# EAGLE design hat_v3 (EAGLE 7.7.0)

## Sheet 1 of 2
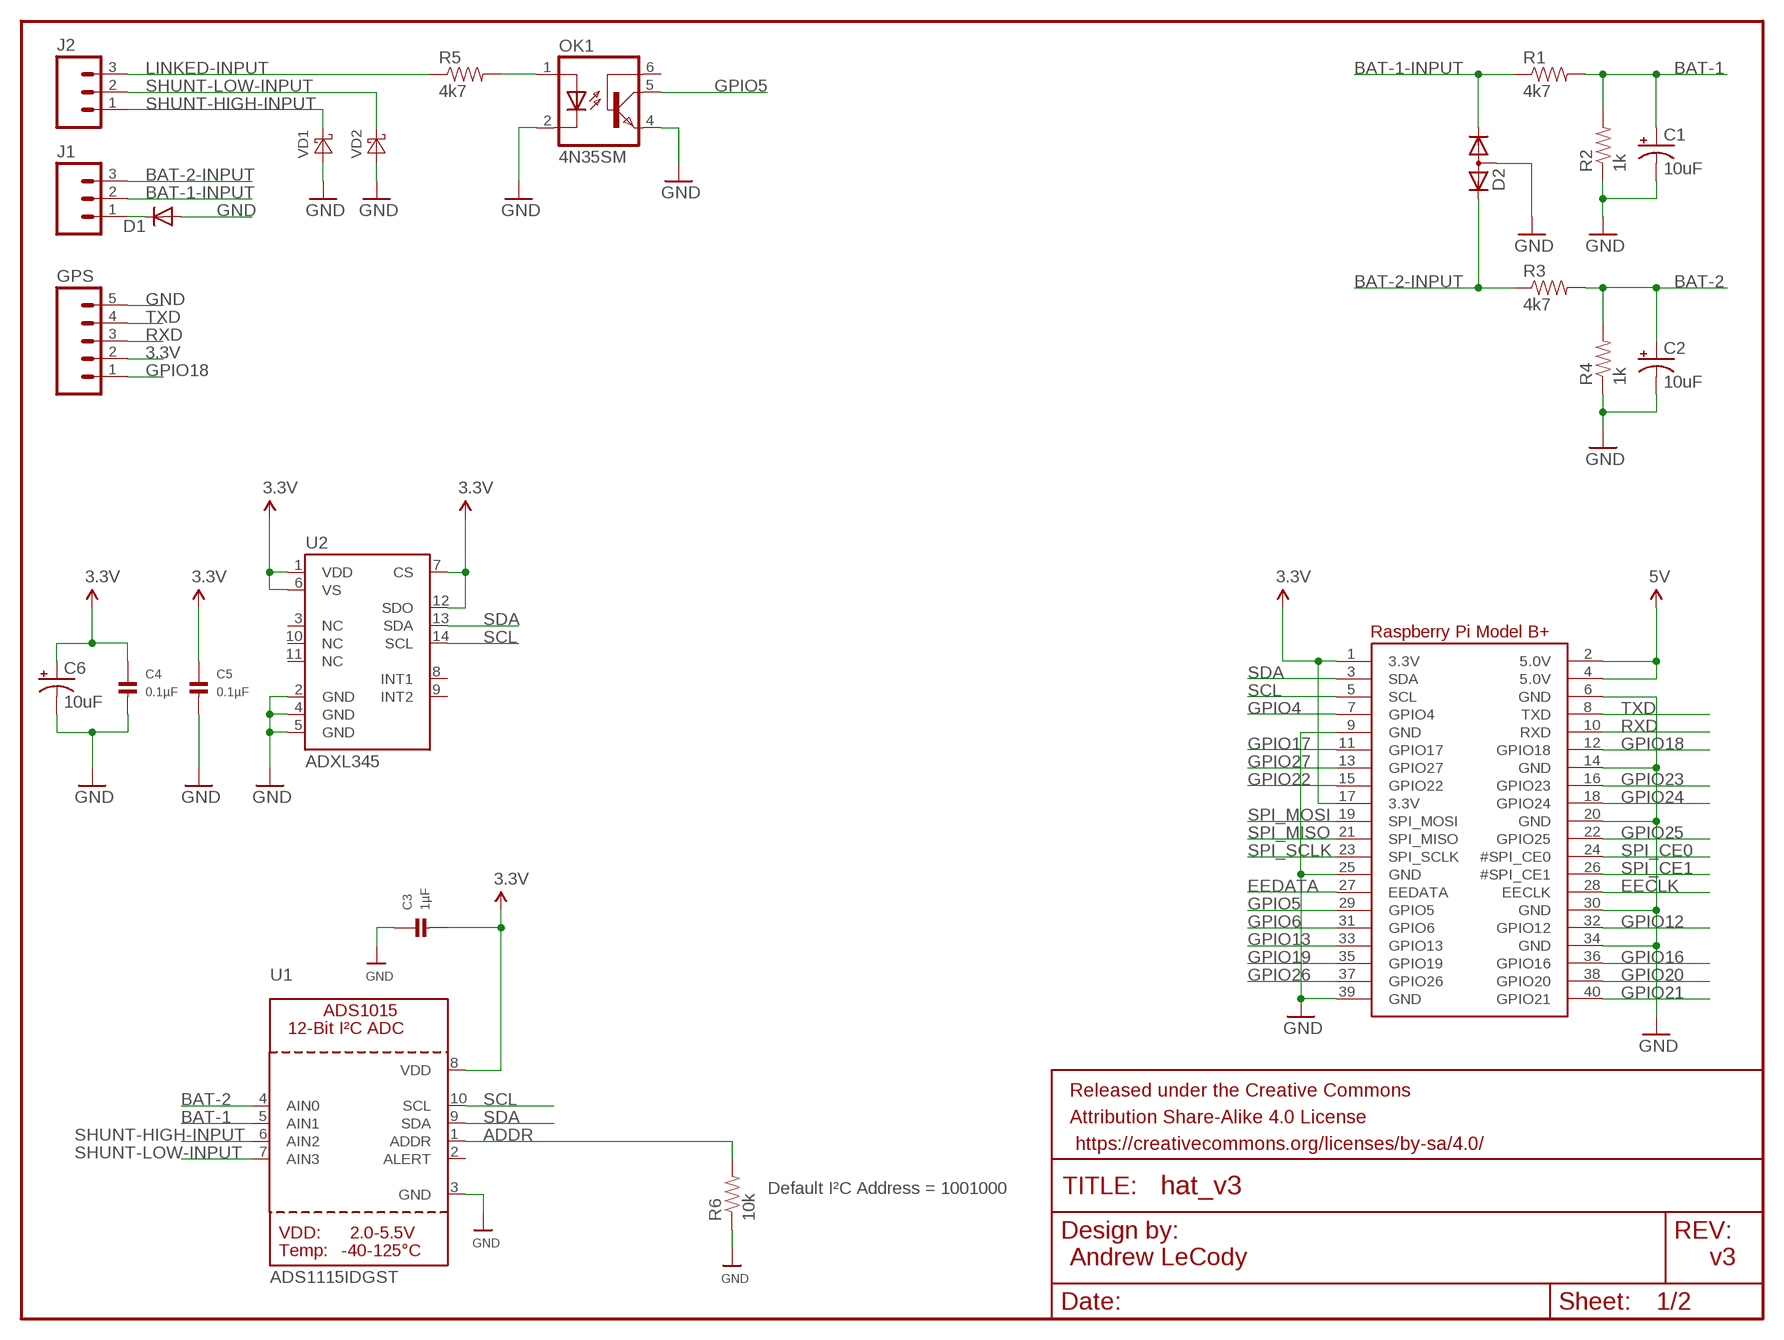
[diagram p0: schematic, sheet 1]

### Parts
C1  10uF  CAP_POL1206  [EIA3216]
C2  10uF  CAP_POL1206  [EIA3216]
C3  1µF  CAP_CERAMIC0805  [0805]
C4  0.1µF  CAP_CERAMIC0805  [0805]
C5  0.1µF  CAP_CERAMIC0805  [0805]
C6  10uF  CAP_POL1206  [EIA3216]
D1  DIODE-DO214AC  [DO214AC]
D2  DIODE-2CA|ACSOT23  [SOT23]
FRAME1  FRAME-LETTER  [CREATIVE_COMMONS]
GPS  M05PTH  [1X05]
J1  M03-SCREW-5MM  [SCREWTERMINAL-5MM-3]
J2  M03-SCREW-5MM  [SCREWTERMINAL-5MM-3]
OK1  4N35SM  [DIL6-SMD]
R1  4k7  RESISTOR0805-RES  [0805]
R2  1k  RESISTOR0805-RES  [0805]
R3  4k7  RESISTOR0805-RES  [0805]
R4  1k  RESISTOR0805-RES  [0805]
R5  4k7  RESISTOR0805-RES  [0805]
R6  10k  RESISTOR0805-RES  [0805]
RPI1  RASPBERRYPI_BPLUS_HATNOSLOTS  [PI_HAT_NOSLOTS]
U1  ADS1115IDGST  ADC_ADS1015  [MSOP10]
U2  ADXL345  [LGA14]
VD1  DIODE-SCHOTTKY-SOD523  [SOD523]
VD2  DIODE-SCHOTTKY-SOD523  [SOD523]

### Nets
3.3V: C3.2 C4.1 C5.1 C6.A(+) GPS.2 RPI1.1(3.3V) RPI1.17(3.3V) U1.8(VDD) U2.1(VDD) U2.6(VS) U2.7(CS) U2.12(SDO) ; also sheet 2
5V: RPI1.2(5.0V) RPI1.4(5.0V) ; also sheet 2
ADDR: R6.2 U1.1(ADDR)
BAT-1: C1.A(+) R1.2 R2.2 U1.5(AIN1)
BAT-1-INPUT: D2.1(K1) J1.2 R1.1
BAT-2: C2.A(+) R3.2 R4.2 U1.4(AIN0)
BAT-2-INPUT: D2.2(K2) J1.3 R3.1
EECLK: RPI1.28(EECLK)
EEDATA: RPI1.27(EEDATA)
GND: C1.C(-) C2.C(-) C3.1 C4.2 C5.2 C6.C(-) D1.A D2.3(A) GPS.5 OK1.2(C) OK1.4(EMI) R2.1 R4.1 R6.1 RPI1.6(GND) RPI1.9(GND) RPI1.14(GND) RPI1.20(GND) RPI1.25(GND) RPI1.30(GND) RPI1.34(GND) RPI1.39(GND) U1.3(GND) U2.2(GND) U2.4(GND) U2.5(GND) VD1.A VD2.A ; also sheet 2
GPIO4: RPI1.7(GPIO4)
GPIO5: OK1.5(COL) RPI1.29(GPIO5)
GPIO6: RPI1.31(GPIO6)
GPIO12: RPI1.32(GPIO12)
GPIO13: RPI1.33(GPIO13)
GPIO16: RPI1.36(GPIO16)
GPIO17: RPI1.11(GPIO17)
GPIO18: GPS.1 RPI1.12(GPIO18)
GPIO19: RPI1.35(GPIO19)
GPIO20: RPI1.38(GPIO20)
GPIO21: RPI1.40(GPIO21)
GPIO22: RPI1.15(GPIO22)
GPIO23: RPI1.16(GPIO23)
GPIO24: RPI1.18(GPIO24)
GPIO25: RPI1.22(GPIO25) ; also sheet 2
GPIO26: RPI1.37(GPIO26)
GPIO27: RPI1.13(GPIO27)
LINKED-INPUT: J2.3 R5.1
N$3: OK1.1(A) R5.2
RXD: GPS.3 RPI1.10(RXD)
SCL: RPI1.5(SCL) U1.10(SCL) U2.14(SCL)
SDA: RPI1.3(SDA) U1.9(SDA) U2.13(SDA)
SHUNT-HIGH-INPUT: J2.1 U1.6(AIN2) VD1.C
SHUNT-LOW-INPUT: J2.2 U1.7(AIN3) VD2.C
SPI_CE0: RPI1.24(#SPI_CE0) ; also sheet 2
SPI_CE1: RPI1.26(#SPI_CE1)
SPI_MISO: RPI1.21(SPI_MISO) ; also sheet 2
SPI_MOSI: RPI1.19(SPI_MOSI) ; also sheet 2
SPI_SCLK: RPI1.23(SPI_SCLK) ; also sheet 2
TXD: GPS.4 RPI1.8(TXD)
VEHICLE-GND: D1.C J1.1
Unconnected: OK1.6(BAS) U1.2(ALERT) U2.3(NC) U2.8(INT1) U2.9(INT2) U2.10(NC) U2.11(NC)

### Notes on the sheet
- Default I²C Address = 1001000
- Andrew LeCody | v3

## Sheet 2 of 2
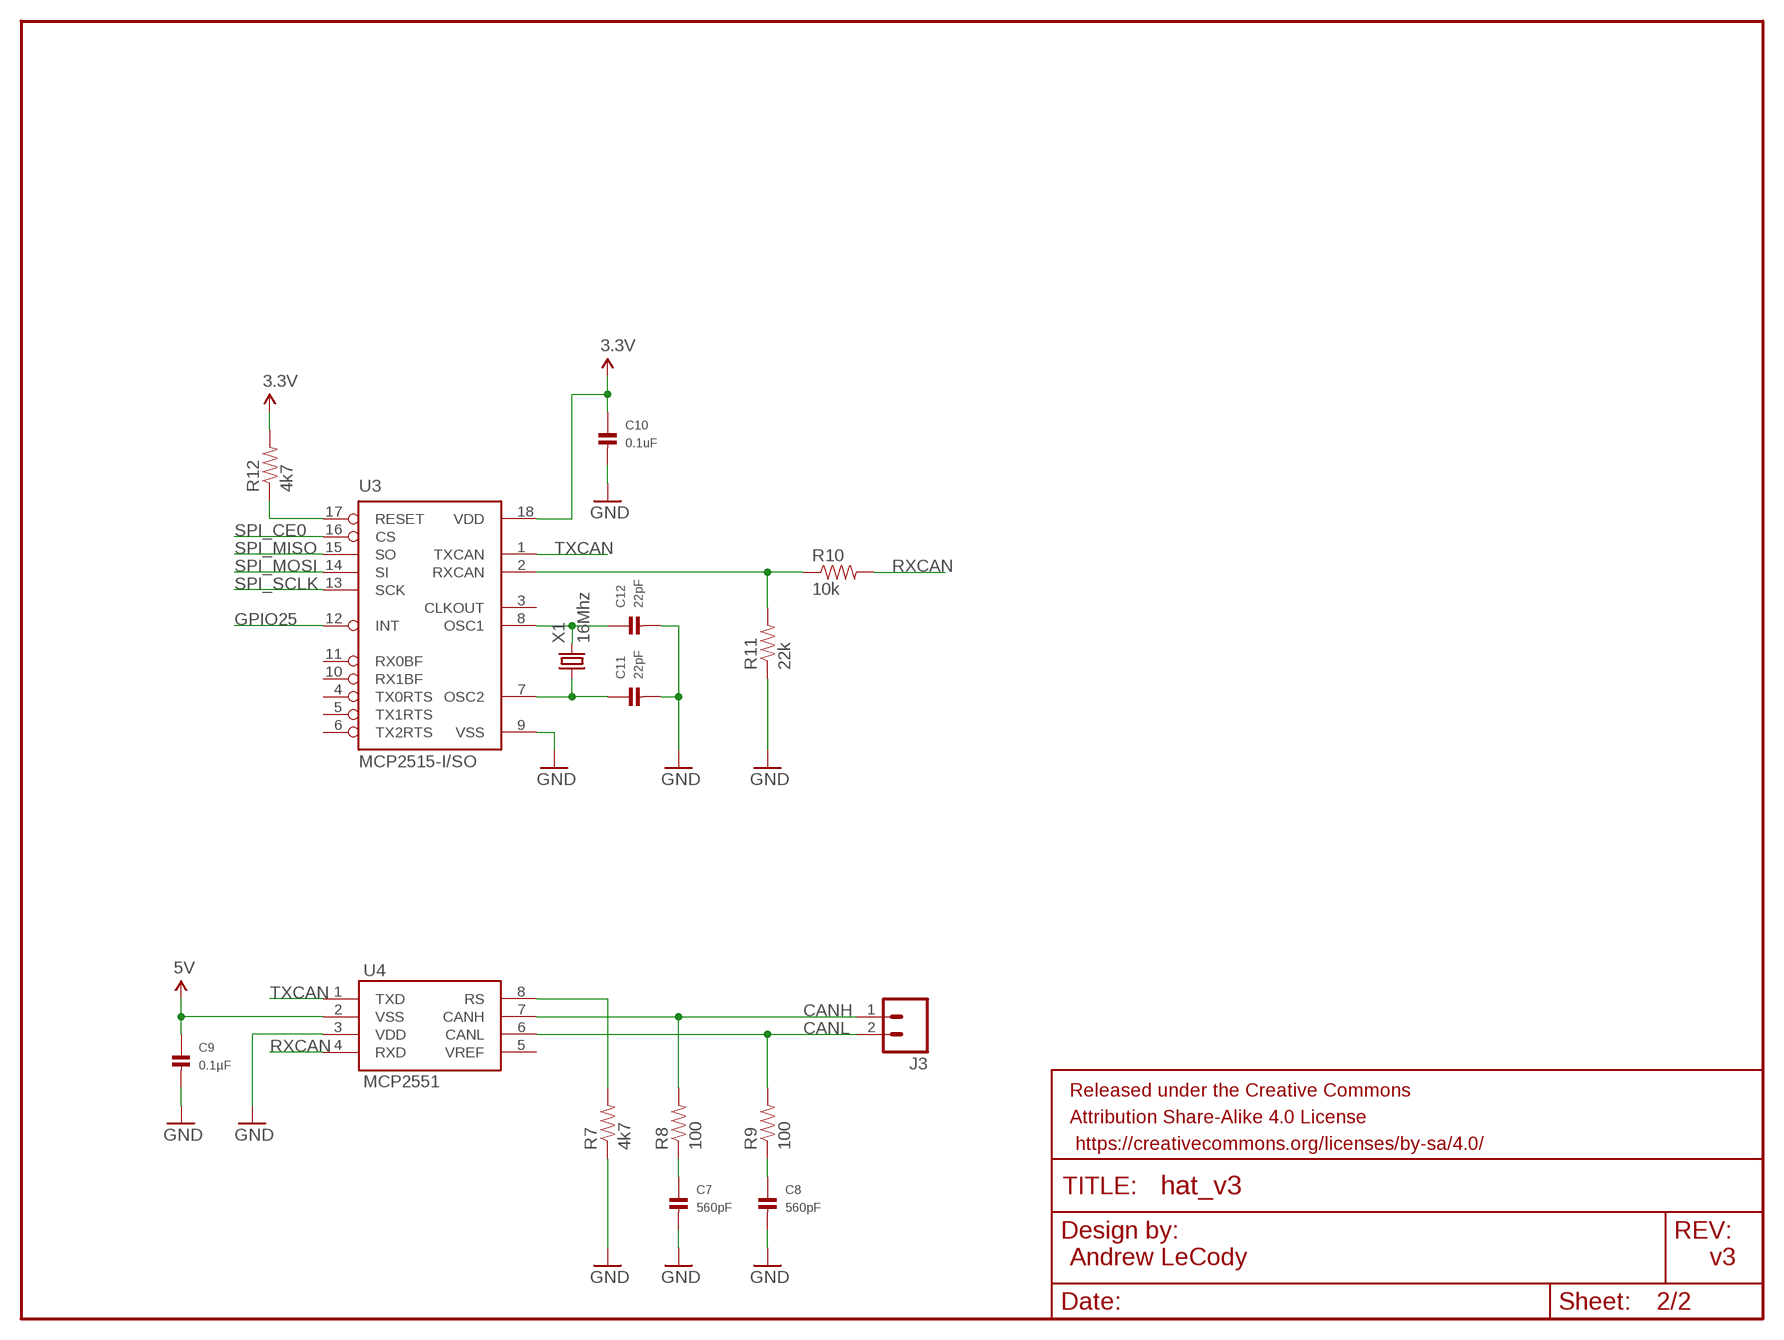
[diagram p1: schematic, sheet 2]

### Parts
C7  560pF  CAP_CERAMIC0805  [0805]
C8  560pF  CAP_CERAMIC0805  [0805]
C9  0.1µF  CAP_CERAMIC0805  [0805]
C10  0.1uF  CAP_CERAMIC0805  [0805]
C11  22pF  CAP_CERAMIC0805  [0805]
C12  22pF  CAP_CERAMIC0805  [0805]
FRAME2  FRAME-LETTERNO_PACKAGE  [DUMMY]
J3  M025MM  [SCREWTERMINAL-5MM-2]
R7  4k7  RESISTOR0805-RES  [0805]
R8  100  RESISTOR0805-RES  [0805]
R9  100  RESISTOR0805-RES  [0805]
R10  10k  RESISTOR0805-RES  [0805]
R11  22k  RESISTOR0805-RES  [0805]
R12  4k7  RESISTOR0805-RES  [0805]
U3  MCP2515-I/SO  [SO18L]
U4  MCP2551  [SO08]
X1  16Mhz  CRYSTALS-NOGND-4-HSMX  [HC49-4-HSMX]

### Nets
3.3V: C10.1 R12.2 U3.18(VDD) ; also sheet 1
5V: C9.1 U4.2(VSS) ; also sheet 1
CANH: J3.1 R8.2 U4.7(CANH)
CANL: J3.2 R9.2 U4.6(CANL)
GND: C7.2 C8.2 C9.2 C10.2 C11.2 C12.2 R7.1 R11.1 U3.9(VSS) U4.3(VDD) ; also sheet 1
GPIO25: U3.12(INT) ; also sheet 1
N$4: R10.1 R11.2 U3.2(RXCAN)
N$6: C7.1 R8.1
N$8: C8.1 R9.1
N$14: C12.1 U3.8(OSC1) X1.2
N$15: C11.1 U3.7(OSC2) X1.1
RS: R7.2 U4.8(RS)
RXCAN: R10.2 U4.4(RXD)
SPI_CE0: U3.16(CS) ; also sheet 1
SPI_MISO: U3.15(SO) ; also sheet 1
SPI_MOSI: U3.14(SI) ; also sheet 1
SPI_SCLK: U3.13(SCK) ; also sheet 1
TXCAN: U3.1(TXCAN) U4.1(TXD)
U5_RST: R12.1 U3.17(RESET)
Unconnected: U3.3(CLKOUT) U3.4(TX0RTS) U3.5(TX1RTS) U3.6(TX2RTS) U3.10(RX1BF) U3.11(RX0BF) U4.5(VREF)

### Notes on the sheet
- Andrew LeCody | v3

## Library data of the parts
C1 C2 C6 = SparkFun-Capacitors:CAP_POL: Capacitor Polarized These are standard SMD and PTH capacitors. Normally 10uF, 47uF, and 100uF in electrolytic and tantalum varieties. Always verify the external diameter of the through hole cap, it varies with capacity, voltage, and manufacturer. The EIA devices should be standard.
C3-C5 C7-C12 = microbuilder:CAP_CERAMIC: Ceramic Capacitors 0402 - 0402 Surface Mount Capacitors 16pF 50V 5% [Digikey: 445-4899-2-ND] 18pF 50V 5% [Digikey: 490-1281-2-ND] 22pF 50V 5% [Digikey: 490-1283-2-ND] 68pF 50V 5% [Digikey: 490-1289-2-ND] 0.1uF 10V 10% [Digikey: 490-1318-2-ND] 1.0uF 6.3V 10% [Digikey: 490-1320-2-ND] 0603 - 0603 Surface Mount Capacitors 16 pF 50V 5% [Digikey: 445-5051-2-ND] 22 pF 50V [Digikey: PCC220ACVTR-ND] 33 pF 50V 5% [Digikey: 490-1415-1-ND] 56pF 50V 5% [Digikey: 490-1421-1-ND] 220pF 50V 5% [Digikey: 445-1285-1-ND] 680 pF 50V 2200 pF 50V 5% C0G [Digikey: 445-1297-1-ND] 5600 pF 100V 5% X7R [Digikey: 478-3711-1-ND] 0.1 µF 25V 10% [Digikey: PCC2277TR-ND] 0.22 µF 16V 10% X7R [Digikey: 445-1318-1-ND] 1.0 µF 25V 10% [Digikey: 445-5146-2-ND] 0603 - RF Specific 3pF 250V +/-0.1pF RF [Digikey: 712-1347-1-ND] 18 pF 250V 5% [Digikey: 478-3505-1-ND or 712-1322-1-ND] 56 pF 250V 5% C0G RF [Digikey: 490-4867-1-ND] 68 pF 250V RF [Digikey: 490-4868-1-ND] 0805 - 0805 Surface Mount Capacitors 220 pF 250V 2% RF Ceramic Capacitor [Digikey: 712-1398-1-ND] 1000 pF 50V 2% NP0 Ceramic Capacitor [Digikey: 478-3760-1-ND] 0.1 µF 25V 10% Ceramic Capacitor [Digikey: PCC1828TR-ND] 1.0 µF 16V 10% Ceramic Capacitor[Digikey: 490-1691-2-ND] 10.0 µF 10V 10% Ceramic Capacitor[Digikey: 709-1228-1-ND] 10.0 uF 16V 10% Ceramic Capacitor [Digikey: 478-5165-2-ND] 47 uF 6.3V 20% Ceramic Capacitor [Digikey: 587-1779-1-ND or 399-5506-1-ND] 1206 - 1206 Surface Mount Capacitors 47uF 10V 20% Ceramic Capacitor [Digikey: 490-5528-1-ND or 399-5508-1-ND or 445-6010-1-ND] 100uF 6.3V -20%, +80% Y5V Ceramic Capacitor (Digikey: 490-4512-1-ND, Mouser: 81-GRM31CF50J107ZE1L)
D1 = diode:DIODE-: DIODE
D2 = diode:DIODE-2CA|AC: Dual DIODE Cathode-Anode|Anode-Cathode
FRAME1 = SparkFun-Aesthetics:FRAME-LETTER: Schematic Frame Standard 8.5x11 US Letter frame
FRAME2 = SparkFun-Aesthetics:FRAME-LETTER: Schematic Frame Standard 8.5x11 US Letter frame; DESIGNER: Nobody; VERSION: v01
GPS = SparkFun-Connectors:M05: Header 5 Standard 5-pin 0.1" header. Use with straight break away headers (SKU : PRT-00116), right angle break away headers (PRT-00553), swiss pins (PRT-00743), machine pins (PRT-00117), and female headers (PRT-00115). Molex polarized connector foot print use with SKU : PRT-08230 with associated crimp pins and housings.
J1 J2 = SparkFun-Connectors:M03: Header 3 Standard 3-pin 0.1" header. Use with straight break away headers (SKU : PRT-00116), right angle break away headers (PRT-00553), swiss pins (PRT-00743), machine pins (PRT-00117), and female headers (PRT-00115). Molex polarized connector foot print use with SKU : PRT-08232 with associated crimp pins and housings.; STOREFRONT_ID: PRT-08433
J3 = SparkFun-Connectors:M02: Standard 2-pin 0.1" header. Use with - straight break away headers ( PRT-00116) - right angle break away headers (PRT-00553) - swiss pins (PRT-00743) - machine pins (PRT-00117) - female headers (PRT-00115) Molex polarized connector foot print use with: PRT-08233 with associated crimp pins and housings. 2.54_SCREWTERM for use with PRT-10571. 3.5mm Screw Terminal footprints for PRT-08084 5mm Screw Terminal footprints for use with PRT-08432; STOREFRONT_ID: PRT-08432
OK1 = optocoupler:4N*?M: General Purpose 6-Pin Phototransistor Optocouplers Source: http://www.fairchildsemi.com/ds/4N/4N35-M.pdf; MF: FAIRCHILD SEMICONDUCTOR; MPN: 4N35S-M; OC_FARNELL: 1021179; OC_NEWARK: 67K2285
R1-R12 = SparkFun-Passives:RESISTOR: Resistor Basic schematic elements and footprints for 0603, 1206, and PTH resistors.
RPI1 = microbuilder:RASPBERRYPI_BPLUS
U1 = microbuilder:ADC_ADS1015: ADS1015 - 12-bit 4-Channel I2C ADC with Internal PGA VDD: 2.0-5.5V Sampling Rate: 3.3ksps Gain Settings: 2/3, 1, 2, 4, 8, 16 I2C Address: ADDR low = 1001000x, ADDR high = 1001001x Internal Comparator The ADS1015 includes an internal comparator that can be set to output a high-level on ALERT when the conversion results exceeeds a pre-defined upper level, and will deassert itself when the level falls below a pre-defined lower threshold level. It can also be set to windowed mode where the ALERT pin will be asserted if the data exceeds the upper threshold or falls below the lower threshold.
U2 = SparkFun-Sensors:ADXL345: 3-axis SPI/I2C 2/4/8/16g accelerometer
U3 = mcp2515:MCP2515
U4 = SparkFun-DigitalIC:MCP2551: CAN transceiver; PROD_ID: IC-09907
VD1 VD2 = diode:DIODE-SCHOTTKY-: SCHOTTKY DIODE
X1 = IQD-Frequency-Products:CRYSTALS-NOGND: CRYSTALS CAN NOT GROUNDED

## Board
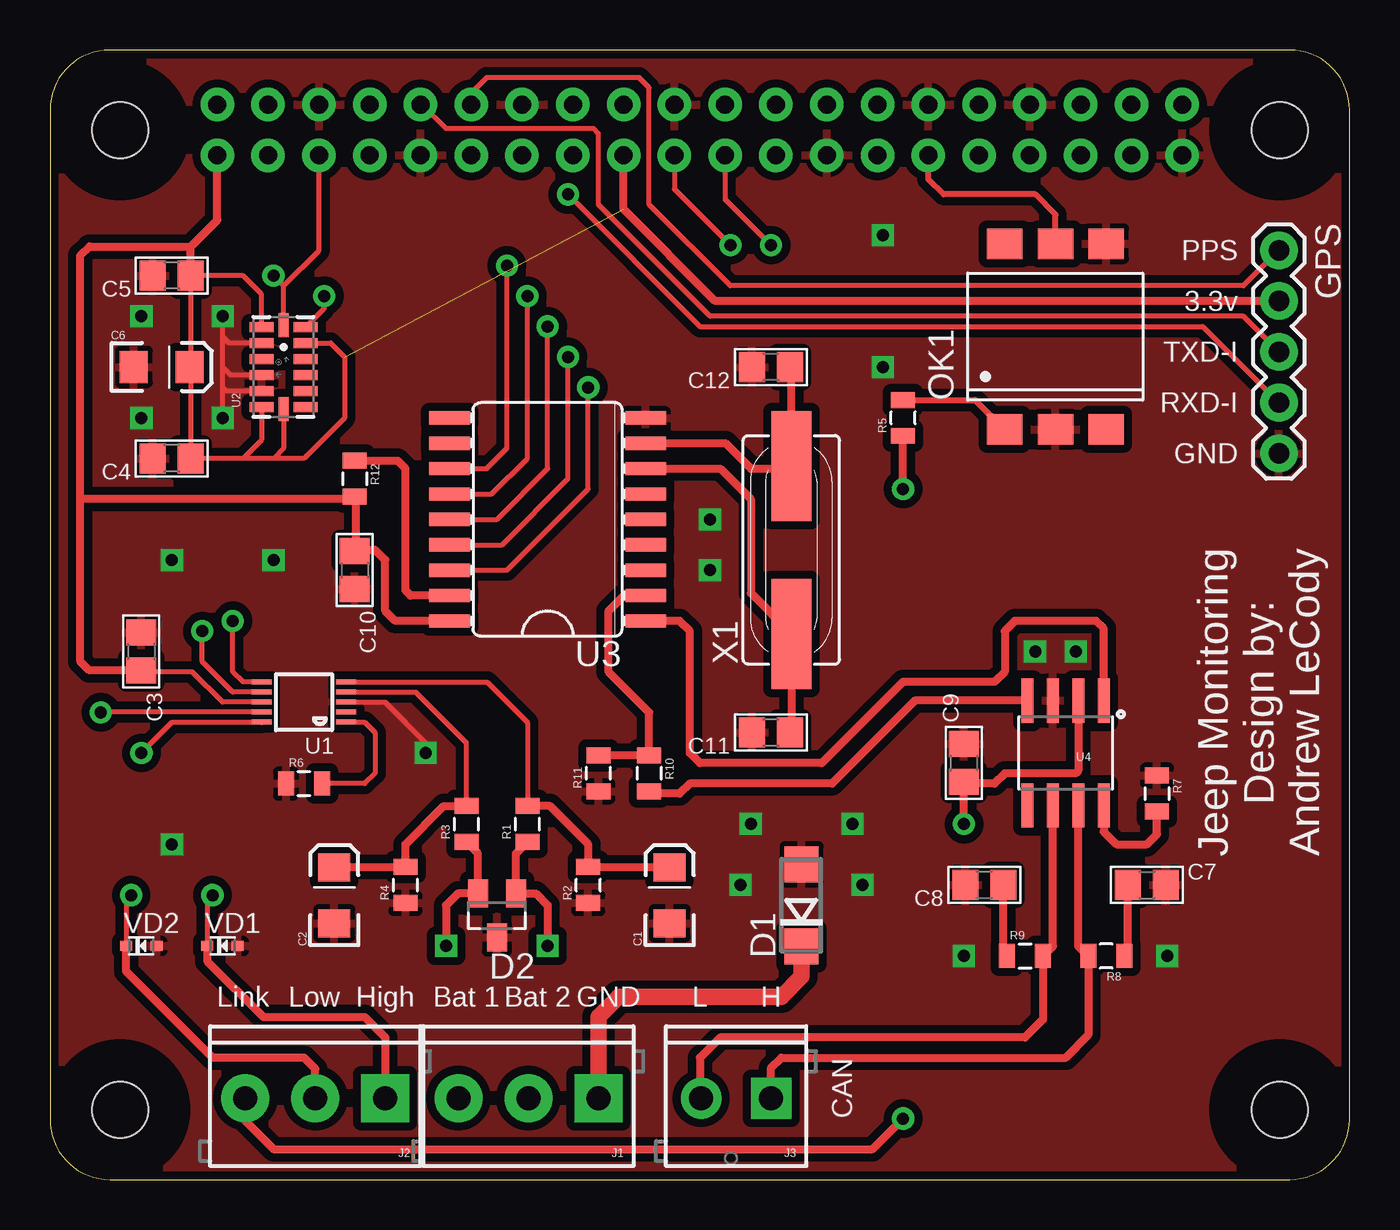
[diagram p2: board, top side]
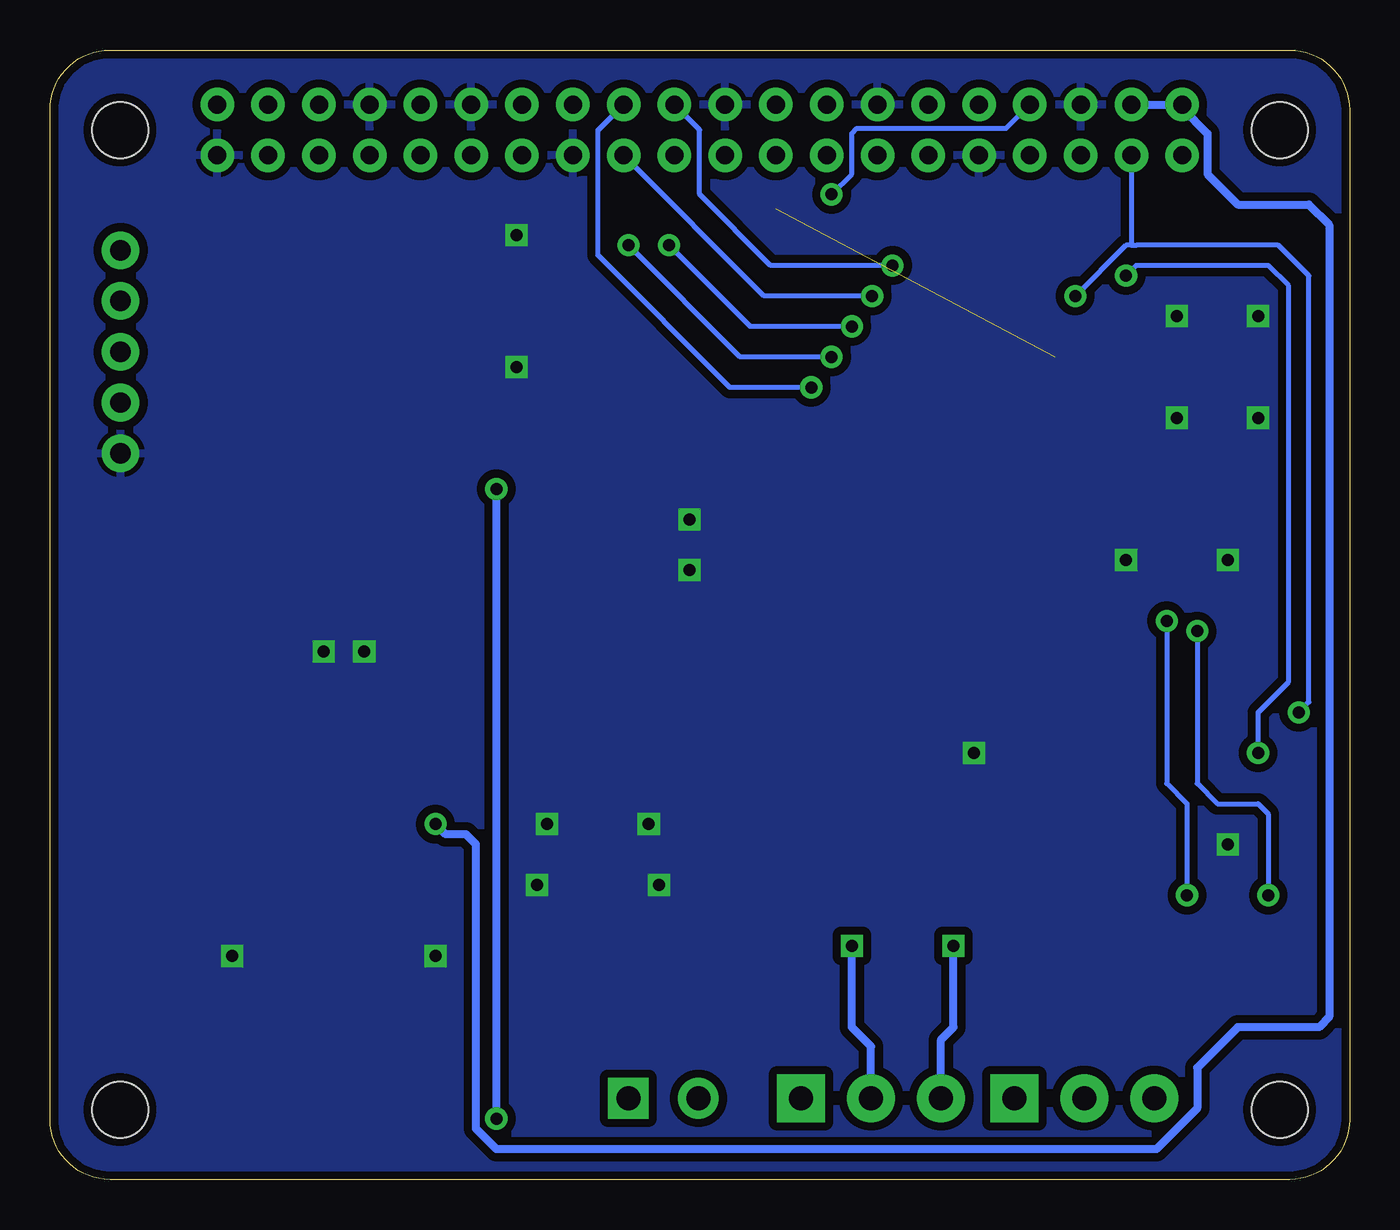
[diagram p3: board, bottom side, seen from below]

Size 65 x 56.5 mm. Coordinates in mm from the lower left corner, seen from the top.
Copper layers (1*16): Top 0.035mm / dielectric 1.5mm / Bottom 0.035mm
Design rules "SparkFun": minimum track width 8mil, minimum drill 20mil, track to track 8mil, track to pad 8mil, pad to pad 8mil, via to via 8mil, smd to smd 8mil, copper to edge 8mil, drill to drill 8mil, minimum pad ring 12mil, minimum via ring 10mil, stop-mask expansion 4mil, vias tented up to drill 20mil, thermal gap 10mil

### Footprints (pad centres in the part's own frame; a part is rotated, then mirrored left to right if it is on the bottom)
EIA3216 = smd 1.4 x 1.6: A 1.4,0; C -1.4,0
0805 = smd 1.3 x 1.5: 1 -0.95,0; 2 0.95,0
DO214AC = smd 1.8 x 1.7: A 2.05,0; C -2.05,0
SOT23 = smd 1 x 1.4: 1 -0.95,-1.1; 2 0.95,-1.1; 3 0,1.1
1X05 = drill 1.016 pad 1.88: 1 0,0; 2 2.54,0; 3 5.08,0; 4 7.62,0; 5 10.16,0
SCREWTERMINAL-3.5MM-3 = drill 1.2 pad 2.413 square: 1 0,0 | drill 1.2 pad 2.413: 2 3.5,0; 3 7,0
SCREWTERMINAL-3.5MM-2 = drill 1.2 pad 2.032 square: 1 0,0 | drill 1.2 pad 2.032: 2 3.5,0
DIL6-SMD = smd 1.78 x 1.52: 1 -2.54,-4.645; 2 0,-4.645; 3 2.54,-4.645; 4 2.54,4.645; 5 0,4.645; 6 -2.54,4.645
0805' = smd 0.8 x 1.2: 1 -0.9,0; 2 0.9,0
PI_HAT_NOSLOTS = drill 0.9 pad 1.676: 1 8.37,51.23; 2 8.37,53.77; 3 10.91,51.23; 4 10.91,53.77; 5 13.45,51.23; 6 13.45,53.77; 7 15.99,51.23; 8 15.99,53.77; 9 18.53,51.23; 10 18.53,53.77; 11 21.07,51.23; 12 21.07,53.77; 13 23.61,51.23; 14 23.61,53.77; 15 26.15,51.23; 16 26.15,53.77; 17 28.69,51.23; 18 28.69,53.77; 19 31.23,51.23; 20 31.23,53.77; 21 33.77,51.23; 22 33.77,53.77; 23 36.31,51.23; 24 36.31,53.77; 25 38.85,51.23; 26 38.85,53.77; 27 41.39,51.23; 28 41.39,53.77; 29 43.93,51.23; 30 43.93,53.77; 31 46.47,51.23; 32 46.47,53.77; 33 49.01,51.23; 34 49.01,53.77; 35 51.55,51.23; 36 51.55,53.77; 37 54.09,51.23; 38 54.09,53.77; 39 56.63,51.23; 40 56.63,53.77 | hole 2.8: 3.5,3.5; 3.5,52.5; 61.5,52.5; 61.5,3.5
MSOP10 = smd 0.25 x 1: 1 -1,-2.113; 2 -0.5,-2.113; 3 0,-2.113; 4 0.5,-2.113; 5 1,-2.113; 6 1,2.113; 7 0.5,2.113; 8 0,2.113; 9 -0.5,2.113; 10 -1,2.113
LGA14 = smd 0.5 x 1.2: 1 2,1.1; 2 1.2,1.1; 3 0.4,1.1; 4 -0.4,1.1; 5 -1.2,1.1; 6 -2,1.1; 8 -2,-1.1; 9 -1.2,-1.1; 10 -0.4,-1.1; 11 0.4,-1.1; 12 1.2,-1.1; 13 2,-1.1 | smd 1.2 x 0.5: 7 -2.1,0; 14 2.1,0
SO18L = smd 0.66 x 2.032: 1 -5.08,-4.902; 2 -3.81,-4.902; 3 -2.54,-4.902; 4 -1.27,-4.902; 5 0,-4.902; 6 1.27,-4.902; 7 2.54,-4.902; 8 3.81,-4.902; 9 5.08,-4.902; 10 5.08,4.902; 11 3.81,4.902; 12 2.54,4.902; 13 1.27,4.902; 14 0,4.902; 15 -1.27,4.902; 16 -2.54,4.902; 17 -3.81,4.902; 18 -5.08,4.902
SO08 = smd 0.61 x 2.21: 1 -1.905,-2.616; 2 -0.635,-2.616; 3 0.635,-2.616; 4 1.905,-2.616; 5 1.905,2.616; 6 0.635,2.616; 7 -0.635,2.616; 8 -1.905,2.616
SOD523 = smd 0.6 x 0.5: A 0.762,0; C -0.762,0
HC49-4-HSMX = smd 5.5 x 2: 1 -4.2,0; 2 4.2,0

### Placement (x,y rotation side)
C1  30.99,14.22 90 top
C2  14.22,14.22 90 top
C3  4.57,26.42 270 top
C4  6.1,36.07 180 top
C5  6.1,45.21 180 top
C6  5.59,40.64 0 top
C7  54.86,14.73 0 top
C8  46.74,14.73 180 top
C9  45.72,20.83 90 top
C10  15.24,30.48 270 top
C11  36.07,22.35 180 top
C12  36.07,40.64 180 top
D1  37.59,13.72 90 top
D2  22.35,13.21 180 top
FRAME1  2.54,-8.89 0 top  (outside the outline)
FRAME2  -32.51,-66.04 0 top  (outside the outline)
GPS  61.47,46.48 270 top
J1  [SCREWTERMINAL-3.5MM-3]  27.43,4.06 180 top
J2  [SCREWTERMINAL-3.5MM-3]  16.76,4.06 180 top
J3  [SCREWTERMINAL-3.5MM-2]  36.07,4.06 180 top
OK1  50.29,42.16 0 top
R1  4k7  [0805']  23.88,17.78 90 top
R2  1k  [0805']  26.92,14.73 90 top
R3  4k7  [0805']  20.83,17.78 90 top
R4  1k  [0805']  17.78,14.73 90 top
R5  4k7  [0805']  42.67,38.1 90 top
R6  10k  [0805']  12.7,19.81 0 top
R7  4k7  [0805']  55.37,19.3 270 top
R8  100  [0805']  52.83,11.18 180 top
R9  100  [0805']  48.77,11.18 0 top
R10  10k  [0805']  29.97,20.32 270 top
R11  22k  [0805']  27.43,20.32 90 top
R12  4k7  [0805']  15.24,35.05 270 top
RPI1  0,0 0 top
U1  12.7,23.88 90 top
U2  11.68,40.64 90 top
U3  24.89,33.02 90 top
U4  50.8,21.34 180 top
VD1  8.64,11.68 0 top
VD2  4.57,11.68 0 top
X1  37.08,31.5 90 top

### Tracks (layer width: path | path; a pad name or v marks a point on that pad's centre or on a via)
3.3V  (1 unrouted)
  Top 0.254: 7.05,40.7 C5.1 9.65,45.21 10.58,44.28 U2.1 | 7.05,40.7 C6.A | 7.05,40.7 C4.1 9.65,36.07 | U2.6 10.58,37 9.65,36.07 | U2.7 11.68,36.58 11.18,36.07 | 11.18,36.07 9.65,36.07 | U2.12 14.04,41.84 14.73,41.15 14.73,38.1 12.7,36.07 11.18,36.07 | U1.8 8.64,23.88 7.11,25.4 4.64,25.4 C3.2 | R12.2 15.24,34.04
  Top 0.406: GPS.2 33.27,43.94 28.69,48.53 RPI1.17 | U3.18 17.27,27.94 16.76,28.45 16.76,30.99 16.26,31.5 15.31,31.5 | C10.1 15.31,31.5 | 15.31,31.5 15.31,34.09 R12.2 | C5.1 7.05,46.67 | 7.05,46.67 8.37,47.99 RPI1.1 | 7.05,46.67 1.97,46.67 1.52,46.23 1.52,34.04 | C3.2 1.97,25.47 1.52,25.91 1.52,34.04 | 15.24,34.04 1.52,34.04
5V  (via drill 0.6)
  Top 0.406: v45.72,17.78 C9.1 45.79,19.81 47.24,19.81 47.75,20.32 51.31,20.32 51.44,20.45 U4.2
  Bottom 0.406: v45.72,17.78 45.21,17.27 44.2,17.27 43.69,16.76 43.69,2.54 42.67,1.52 9.65,1.52 7.62,3.56 7.62,5.59 5.59,7.62 1.52,7.62 1.02,8.13 1.02,47.75 2.03,48.77 5.59,48.77 7.11,50.29 7.11,52.32 8.37,53.58 RPI1.2 RPI1.4
ADDR
  Top 0.254: U1.1 15.73,22.88 16.26,22.35 16.26,20.32 15.75,19.81 R6.2
BAT-1
  Top 0.254: U1.5 21.86,24.88 23.88,22.86 R1.2
  Top 0.406: C1.A 26.93,15.62 | 26.93,15.62 R2.2 | 26.93,15.62 26.93,16.76 25.01,18.68 R1.2
BAT-1-INPUT  (via drill 0.6)
  Top 0.406: R1.1 23.3,16.31 D2.1 24.3,14.31 24.89,13.72 v24.89,11.68
  Bottom 0.406: J1.2 23.93,6.66 24.89,7.62 v24.89,11.68
BAT-2
  Top 0.254: R3.2 20.83,21.84 18.3,24.38 U1.4
  Top 0.406: C2.A 14.23,15.63 R4.2 17.78,16.76 19.7,18.68 R3.2
BAT-2-INPUT  (via drill 0.6)
  Top 0.406: R3.1 21.4,16.31 D2.2 20.4,14.31 19.81,13.72 v19.81,11.68
  Bottom 0.406: J1.3 20.43,7 19.81,7.62 v19.81,11.68
CANH
  Top 0.406: U4.7 51.44,11.67 R8.2 51.93,7.23 50.8,6.1 36.58,6.1 36.07,5.59 J3.1
CANL
  Top 0.406: U4.6 50.16,11.67 R9.2 49.67,8.01 48.77,7.11 33.53,7.11 32.51,6.1 32.51,4.12 J3.2
GND  (via drill 0.6)
  Top 0.254: U1.3 16.76,23.88 18.8,21.84 v18.8,21.34 | U2.2 8.96,41.84 8.64,42.16 | 8.64,42.16 v8.64,43.18 | U2.4 9.04,40.24 8.64,40.64 | 8.64,40.64 8.64,42.16 | U2.5 8.82,39.44 8.64,39.62 | 8.64,39.62 8.64,40.64 | v8.64,38.1 8.64,39.62
  other vias: 33.02,33.02 33.02,30.48 49.28,26.42 51.31,26.42 40.13,17.78 35.05,17.78 34.54,14.73 4.57,43.18 4.57,38.1 6.1,30.99 11.18,30.99 6.1,16.76 45.72,11.18 55.88,11.18 40.64,14.73 41.66,40.64 41.66,47.24
  pour Bottom (isolate 0.406): 66.04,-1.27 66.04,57.15 -1.27,57.15 -1.27,-1.27
  pour Top (isolate 0.406): -1.27,57.15 66.04,57.15 66.04,-1.27 -1.27,-1.27
GPIO5
  Top 0.305: OK1.5 50.29,48.26 49.28,49.28 44.7,49.28 43.93,50.05 RPI1.29
GPIO18
  Top 0.254: GPS.1 59.69,44.7 34.04,44.7 29.97,48.77 29.97,54.61 29.46,55.12 21.84,55.12 21.07,54.34 RPI1.12
GPIO25  (via drill 0.6)
  Top 0.254: U3.12 21.84,35.56 22.86,36.58 v22.86,45.72
  Bottom 0.254: RPI1.22 32.51,52.51 32.51,49.28 28.96,45.72 v22.86,45.72
LINKED-INPUT  (via drill 0.6)
  Top 0.406: J2.3 9.76,2.94 11.18,1.52 41.15,1.52 v42.67,3.05 | v42.67,34.54 R5.1
  Bottom 0.406: v42.67,3.05 v42.67,34.54
N$3
  Top 0.305: R5.2 46.27,39 OK1.1
N$4
  Top 0.406: R11.2 R10.1 29.97,23.37 27.94,25.4 27.94,28.45 28.7,29.21 U3.2
N$6
  Top 0.406: R8.1 53.91,11.36 C7.1
N$8
  Top 0.406: R9.1 47.69,11.36 C8.1
N$14
  Top 0.406: U3.8 33.78,36.83 35.05,35.56 36.95,35.56 X1.2 37.08,40.57 C12.1
N$15
  Top 0.406: U3.7 33.53,35.56 35.05,34.04 35.05,29.33 X1.1 37.08,22.42 C11.1
RS
  Top 0.406: U4.8 52.7,17.4 53.34,16.76 54.86,16.76 55.37,17.27 R7.2
RXCAN
  Top 0.406: U4.4 43.26,23.95 39.12,19.81 32,19.81 31.5,19.3 30.09,19.3 R10.2
RXD
  Top 0.254: GPS.3 59.69,43.18 33.02,43.18 27.43,48.77 27.43,52.32 27.18,52.58 19.81,52.58 18.62,53.77 RPI1.10
SCL  (via drill 0.6)
  Top 0.254: U2.14 11.68,44.7 | 11.68,44.7 13.45,46.47 RPI1.5 | U1.10 10.57,22.86 6.1,22.86 v4.57,21.34 | v11.18,45.21 11.68,44.7
  Bottom 0.254: v4.57,21.34 4.57,23.37 3.05,24.89 3.05,44.7 4.06,45.72 10.67,45.72 v11.18,45.21
SDA  (via drill 0.6)
  Top 0.254: U2.13 13.72,43.57 v13.72,44.2 | U1.9 v2.55,23.38 v2.54,23.37
  Bottom 0.254: v13.72,44.2 11.18,46.74 10.91,46.74 | v2.54,23.37 2.03,23.88 2.03,45.21 3.56,46.74 10.67,46.74 10.91,46.74 | RPI1.3 10.91,46.74
SHUNT-HIGH-INPUT  (via drill 0.6)
  Top 0.254: U1.6 10.57,24.89 9.65,24.89 9.14,25.4 v9.14,27.94 | v8.13,14.22 7.87,13.97 VD1.C
  Top 0.406: VD1.C 7.87,10.92 10.67,8.13 15.75,8.13 16.76,7.11 J2.1
  Bottom 0.254: v9.14,27.94 9.14,19.81 8.13,18.8 v8.13,14.22
SHUNT-LOW-INPUT  (via drill 0.6)
  Top 0.254: U1.7 9.14,24.38 7.62,25.91 v7.62,27.43 | v4.06,14.22 3.81,13.97 VD2.C
  Top 0.406: J2.2 13.26,5.53 12.7,6.1 8.13,6.1 3.81,10.41 VD2.C
  Bottom 0.254: v7.62,27.43 7.62,19.81 6.6,18.8 4.57,18.8 4.06,18.29 v4.06,14.22
SPI_CE0  (via drill 0.6)
  Top 0.254: U3.16 22.86,30.48 26.92,34.54 v26.92,39.62
  Bottom 0.254: RPI1.24 37.59,52.49 37.59,46.23 30.99,39.62 v26.92,39.62
SPI_MISO  (via drill 0.6)
  Top 0.254: U3.15 22.61,31.75 25.91,35.05 v25.91,41.15 | v36.07,46.74 33.77,49.03 RPI1.21
  Bottom 0.254: v25.91,41.15 30.48,41.15 v36.07,46.74
SPI_MOSI  (via drill 0.6)
  Top 0.254: v34.04,46.74 31.23,49.54 RPI1.19 | U3.14 22.35,33.02 24.89,35.56 v24.89,42.67
  Bottom 0.254: v34.04,46.74 29.97,42.67 v24.89,42.67
SPI_SCLK  (via drill 0.6)
  Top 0.254: U3.13 22.1,34.29 23.88,36.07 v23.88,44.2
  Bottom 0.254: RPI1.23 29.28,44.2 v23.88,44.2
TXCAN
  Top 0.406: U4.1 52.7,27.56 52.32,27.94 48.26,27.94 47.75,27.43 47.75,25.4 47.24,24.89 42.67,24.89 38.61,20.83 32.51,20.83 32,21.34 32,27.43 31.5,27.94 U3.1
TXD  (via drill 0.6)
  Top 0.254: v25.91,49.28 32.51,42.67 57.66,42.67 GPS.4
  Bottom 0.254: v25.91,49.28 24.89,50.29 24.89,52.32 24.64,52.58 17.18,52.58 RPI1.8
U5_RST
  Top 0.406: U3.17 18.03,29.21 17.78,29.46 17.78,35.56 17.39,35.95 R12.1
VEHICLE-GND
  Top 0.813: J1.1 27.43,8.13 28.45,9.14 36.58,9.14 37.59,10.16 D1.C

### Text on the board
tPlace: Jeep Monitoring / Design by: / Andrew LeCody | Link | Low | High | Bat 1 | Bat 2 | GND | L | H | CAN
tNames: PPS | 3.3v | TXD-I | RXD-I | GND
tDocu: Andrew LeCody